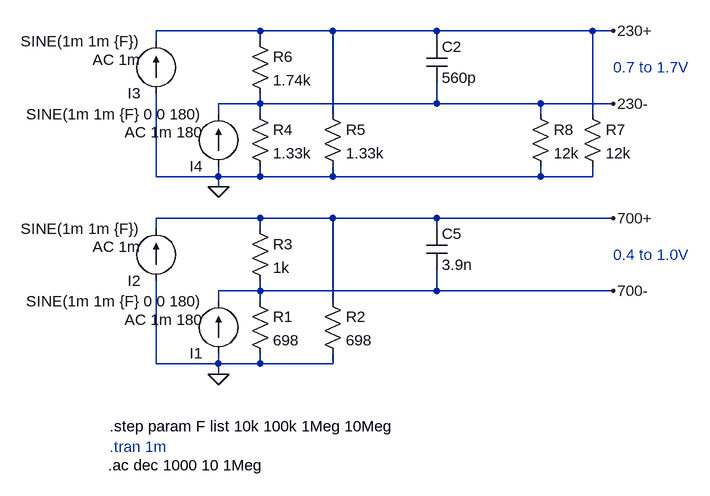
[diagram p0: schematic ModulatorDriver.asc]
ModulatorDriver.asc, the LTspice schematic file:
Version 4
SHEET 1 1016 680
WIRE -256 -208 -416 -208
WIRE -144 -208 -256 -208
WIRE 16 -208 -144 -208
WIRE 256 -208 16 -208
WIRE 288 -208 256 -208
WIRE -416 -192 -416 -208
WIRE -256 -192 -256 -208
WIRE 16 -192 16 -208
WIRE -256 -96 -256 -112
WIRE -256 -96 -320 -96
WIRE 16 -96 16 -128
WIRE 16 -96 -256 -96
WIRE 176 -96 16 -96
WIRE 288 -96 176 -96
WIRE -320 -80 -320 -96
WIRE -256 -80 -256 -96
WIRE -144 -80 -144 -208
WIRE 176 -80 176 -96
WIRE 256 -80 256 -208
WIRE -416 16 -416 -112
WIRE -320 16 -320 0
WIRE -320 16 -416 16
WIRE -256 16 -256 0
WIRE -256 16 -320 16
WIRE -144 16 -144 0
WIRE -144 16 -256 16
WIRE 176 16 176 0
WIRE 176 16 -144 16
WIRE 256 16 256 0
WIRE 256 16 176 16
WIRE -320 32 -320 16
WIRE -256 80 -416 80
WIRE -144 80 -256 80
WIRE 16 80 -144 80
WIRE 288 80 16 80
WIRE -416 96 -416 80
WIRE -256 96 -256 80
WIRE 16 96 16 80
WIRE -256 192 -256 176
WIRE -256 192 -320 192
WIRE 16 192 16 160
WIRE 16 192 -256 192
WIRE 288 192 16 192
WIRE -320 208 -320 192
WIRE -256 208 -256 192
WIRE -144 208 -144 80
WIRE -416 304 -416 176
WIRE -320 304 -320 288
WIRE -320 304 -416 304
WIRE -256 304 -256 288
WIRE -256 304 -320 304
WIRE -144 304 -144 288
WIRE -144 304 -256 304
WIRE -320 320 -320 304
FLAG -320 320 0
FLAG -320 32 0
FLAG 288 -208 230+
FLAG 288 -96 230-
FLAG 288 80 700+
FLAG 288 192 700-
SYMBOL current -320 288 R180
WINDOW 123 24 52 Left 2
WINDOW 39 0 0 Left 0
SYMATTR Value2 AC 1m 180
SYMATTR InstName I1
SYMATTR Value SINE(1m 1m {F} 0 0 180)
SYMBOL current -416 176 R180
WINDOW 123 24 52 Left 2
WINDOW 39 0 0 Left 0
SYMATTR Value2 AC 1m
SYMATTR InstName I2
SYMATTR Value SINE(1m 1m {F})
SYMBOL res -272 192 R0
SYMATTR InstName R1
SYMATTR Value 698
SYMBOL res -160 192 R0
SYMATTR InstName R2
SYMATTR Value 698
SYMBOL res -272 80 R0
SYMATTR InstName R3
SYMATTR Value 1k
SYMBOL res -272 -96 R0
SYMATTR InstName R4
SYMATTR Value 1.33k
SYMBOL res -160 -96 R0
SYMATTR InstName R5
SYMATTR Value 1.33k
SYMBOL res -272 -208 R0
SYMATTR InstName R6
SYMATTR Value 1.74k
SYMBOL res 240 -96 R0
SYMATTR InstName R7
SYMATTR Value 12k
SYMBOL res 160 -96 R0
SYMATTR InstName R8
SYMATTR Value 12k
SYMBOL cap 0 -192 R0
SYMATTR InstName C2
SYMATTR Value 560p
SYMBOL cap 0 96 R0
SYMATTR InstName C5
SYMATTR Value 3.9n
SYMBOL current -416 -112 R180
WINDOW 123 24 52 Left 2
WINDOW 39 0 0 Left 0
SYMATTR Value2 AC 1m
SYMATTR InstName I3
SYMATTR Value SINE(1m 1m {F})
SYMBOL current -320 0 R180
WINDOW 123 24 52 Left 2
WINDOW 39 0 0 Left 0
SYMATTR Value2 AC 1m 180
SYMATTR InstName I4
SYMATTR Value SINE(1m 1m {F} 0 0 180)
TEXT -488 432 Left 2 ;.tran 1m
TEXT 288 136 Left 2 ;0.4 to 1.0V
TEXT 288 -152 Left 2 ;0.7 to 1.7V
TEXT -490 460 Left 2 !.ac dec 1000 10 1Meg
TEXT -488 400 Left 2 !.step param F list 10k 100k 1Meg 10Meg

The netlist it stands for:
* ModulatorDriver.asc
I1 0 700- SINE(1m 1m {F} 0 0 180) AC 1m 180
I2 0 700+ SINE(1m 1m {F}) AC 1m
R1 700- 0 698
R2 700+ 0 698
R3 700+ 700- 1k
R4 230- 0 1.33k
R5 230+ 0 1.33k
R6 230+ 230- 1.74k
R7 230+ 0 12k
R8 230- 0 12k
C2 230+ 230- 560p
C5 700+ 700- 3.9n
I3 0 230+ SINE(1m 1m {F}) AC 1m
I4 0 230- SINE(1m 1m {F} 0 0 180) AC 1m 180
* .tran 1m
* 0.4 to 1.0V
* 0.7 to 1.7V
.ac dec 1000 10 1Meg
.step param F list 10k 100k 1Meg 10Meg
.backanno
.end